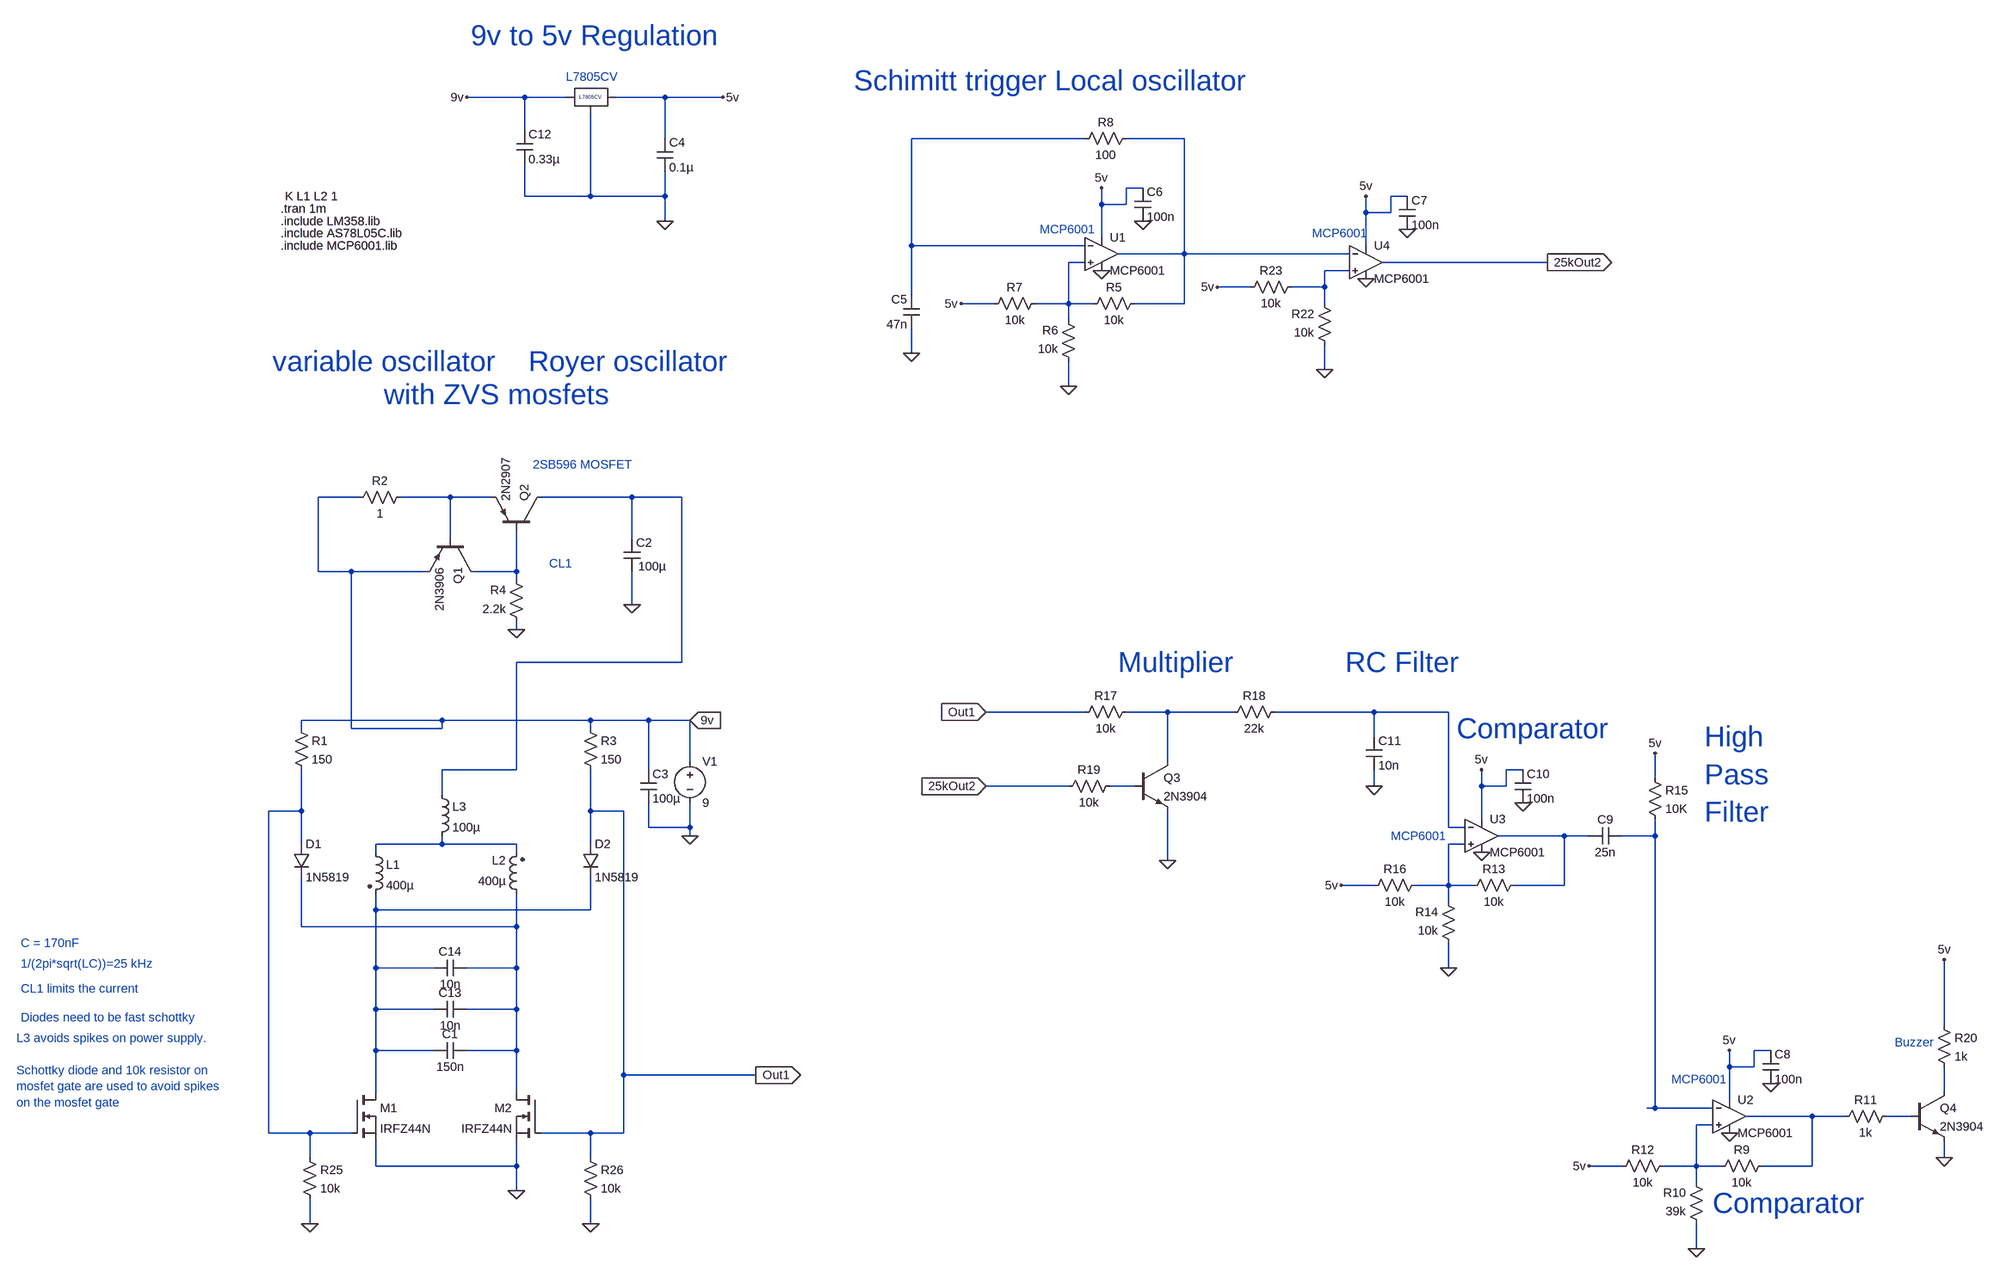
[diagram p0: schematic Model 2.asc]
Model 2.asc, the LTspice schematic file:
Version 4.1
SHEET 1 3832 2088
WIRE 480 -784 368 -784
WIRE 560 -784 480 -784
WIRE 752 -784 656 -784
WIRE 864 -784 752 -784
WIRE 480 -720 480 -784
WIRE 752 -704 752 -784
WIRE 1872 -704 1536 -704
WIRE 2064 -704 1952 -704
WIRE 1984 -608 1952 -608
WIRE 480 -592 480 -656
WIRE 608 -592 608 -752
WIRE 608 -592 480 -592
WIRE 752 -592 752 -640
WIRE 752 -592 608 -592
WIRE 2496 -592 2464 -592
WIRE 1904 -576 1904 -608
WIRE 1952 -576 1952 -608
WIRE 1952 -576 1904 -576
WIRE 2416 -560 2416 -592
WIRE 2464 -560 2464 -592
WIRE 2464 -560 2416 -560
WIRE 752 -544 752 -592
WIRE 1904 -512 1904 -576
WIRE 1536 -496 1536 -704
WIRE 1872 -496 1536 -496
WIRE 2416 -496 2416 -560
WIRE 2064 -480 2064 -704
WIRE 2064 -480 1936 -480
WIRE 2384 -480 2064 -480
WIRE 1872 -464 1840 -464
WIRE 2768 -464 2448 -464
WIRE 2384 -448 2336 -448
WIRE 2192 -416 2128 -416
WIRE 2336 -416 2336 -448
WIRE 2336 -416 2272 -416
WIRE 1536 -400 1536 -496
WIRE 1696 -384 1632 -384
WIRE 1840 -384 1840 -464
WIRE 1840 -384 1776 -384
WIRE 1888 -384 1840 -384
WIRE 2064 -384 2064 -480
WIRE 2064 -384 1968 -384
WIRE 2336 -384 2336 -416
WIRE 1840 -352 1840 -384
WIRE 1536 -288 1536 -336
WIRE 2336 -256 2336 -304
WIRE 1840 -224 1840 -272
WIRE 160 0 80 0
WIRE 336 0 240 0
WIRE 416 0 336 0
WIRE 688 0 512 0
WIRE 784 0 688 0
WIRE 336 80 336 0
WIRE 688 80 688 0
WIRE 80 144 80 0
WIRE 144 144 80 144
WIRE 288 144 144 144
WIRE 464 144 464 64
WIRE 464 144 384 144
WIRE 464 160 464 144
WIRE 688 208 688 144
WIRE 464 256 464 240
WIRE 784 320 784 0
WIRE 784 320 464 320
WIRE 1872 416 1680 416
WIRE 2032 416 1952 416
WIRE 2160 416 2032 416
WIRE 2432 416 2240 416
WIRE 2576 416 2432 416
WIRE 320 432 48 432
WIRE 608 432 320 432
WIRE 720 432 608 432
WIRE 800 432 720 432
WIRE 48 448 48 432
WIRE 144 448 144 144
WIRE 320 448 320 432
WIRE 320 448 144 448
WIRE 608 448 608 432
WIRE 2432 464 2432 416
WIRE 800 512 800 432
WIRE 2032 512 2032 416
WIRE 464 528 464 320
WIRE 464 528 320 528
WIRE 720 528 720 432
WIRE 2720 528 2688 528
WIRE 2976 544 2976 496
WIRE 1840 560 1680 560
WIRE 1968 560 1920 560
WIRE 2432 560 2432 528
WIRE 2640 560 2640 528
WIRE 2688 560 2688 528
WIRE 2688 560 2640 560
WIRE 320 576 320 528
WIRE 48 608 48 528
WIRE 48 608 -16 608
WIRE 608 608 608 528
WIRE 672 608 608 608
WIRE 2640 624 2640 560
WIRE 720 640 720 592
WIRE 800 640 800 592
WIRE 800 640 720 640
WIRE 2576 640 2576 416
WIRE 2608 640 2576 640
WIRE 800 656 800 640
WIRE 2800 656 2672 656
WIRE 2848 656 2800 656
WIRE 2976 656 2976 624
WIRE 2976 656 2912 656
WIRE 48 672 48 608
WIRE 320 672 320 656
WIRE 320 672 192 672
WIRE 464 672 320 672
WIRE 608 672 608 608
WIRE 2608 672 2576 672
WIRE 192 688 192 672
WIRE 464 688 464 672
WIRE 2032 704 2032 608
WIRE 2432 752 2368 752
WIRE 2576 752 2576 672
WIRE 2576 752 2512 752
WIRE 2624 752 2576 752
WIRE 2800 752 2800 656
WIRE 2800 752 2704 752
WIRE 2576 784 2576 752
WIRE 192 800 192 768
WIRE 608 800 608 736
WIRE 608 800 192 800
WIRE 48 832 48 736
WIRE 464 832 464 768
WIRE 464 832 48 832
WIRE 192 912 192 800
WIRE 304 912 192 912
WIRE 464 912 464 832
WIRE 464 912 368 912
WIRE 2576 912 2576 864
WIRE 192 992 192 912
WIRE 304 992 192 992
WIRE 464 992 464 912
WIRE 464 992 368 992
WIRE 3536 1024 3536 896
WIRE 192 1072 192 992
WIRE 304 1072 192 1072
WIRE 464 1072 464 992
WIRE 464 1072 368 1072
WIRE 3200 1072 3168 1072
WIRE 3120 1104 3120 1072
WIRE 3168 1104 3168 1072
WIRE 3168 1104 3120 1104
WIRE 672 1120 672 608
WIRE 928 1120 672 1120
WIRE 192 1152 192 1072
WIRE 464 1152 464 1072
WIRE 3536 1152 3536 1104
WIRE 3120 1168 3120 1104
WIRE 2976 1184 2976 656
WIRE 2976 1184 2960 1184
WIRE 3088 1184 2976 1184
WIRE 3280 1200 3152 1200
WIRE 3344 1200 3280 1200
WIRE 3472 1200 3424 1200
WIRE 3088 1216 3056 1216
WIRE -16 1232 -16 608
WIRE 64 1232 -16 1232
WIRE 144 1232 64 1232
WIRE 608 1232 512 1232
WIRE 672 1232 672 1120
WIRE 672 1232 608 1232
WIRE 64 1280 64 1232
WIRE 608 1280 608 1232
WIRE 3536 1280 3536 1248
WIRE 192 1296 192 1248
WIRE 464 1296 464 1248
WIRE 464 1296 192 1296
WIRE 2912 1296 2848 1296
WIRE 3056 1296 3056 1216
WIRE 3056 1296 2992 1296
WIRE 3104 1296 3056 1296
WIRE 3280 1296 3280 1200
WIRE 3280 1296 3184 1296
WIRE 3056 1328 3056 1296
WIRE 464 1344 464 1296
WIRE 64 1408 64 1360
WIRE 608 1408 608 1360
WIRE 3056 1456 3056 1408
FLAG 464 1344 0
FLAG 800 656 0
FLAG 464 256 0
FLAG 688 208 0
FLAG 928 1120 Out1
IOPIN 928 1120 Out
FLAG 800 432 9v
IOPIN 800 432 In
FLAG 752 -544 0
FLAG 368 -784 9v
FLAG 864 -784 5v
FLAG 1840 -224 0
FLAG 1536 -288 0
FLAG 1904 -448 0
FLAG 1984 -544 0
FLAG 1904 -608 5v
FLAG 1632 -384 5v
FLAG 3056 1456 0
FLAG 3120 1232 0
FLAG 3200 1136 0
FLAG 3120 1072 5v
FLAG 2848 1296 5v
FLAG 2576 912 0
FLAG 2640 688 0
FLAG 2720 592 0
FLAG 2640 528 5v
FLAG 2368 752 5v
FLAG 2032 704 0
FLAG 2432 560 0
FLAG 2976 496 5v
FLAG 1680 416 Out1
IOPIN 1680 416 In
FLAG 1680 560 25kOut2
IOPIN 1680 560 In
FLAG 3536 1280 0
FLAG 3536 896 5v
FLAG 64 1408 0
FLAG 608 1408 0
FLAG 2416 -432 0
FLAG 2496 -528 0
FLAG 2416 -592 5v
FLAG 2336 -256 0
FLAG 2128 -416 5v
FLAG 2768 -464 25kOut2
IOPIN 2768 -464 Out
SYMBOL res 32 432 R0
SYMATTR InstName R1
SYMATTR Value 150
SYMBOL res 592 432 R0
SYMATTR InstName R3
SYMATTR Value 150
SYMBOL ind2 176 672 R0
SYMATTR InstName L1
SYMATTR Value 400µ
SYMATTR Type ind
SYMBOL ind2 480 784 R180
WINDOW 0 36 80 Left 2
WINDOW 3 36 40 Left 2
SYMATTR InstName L2
SYMATTR Value 400µ
SYMATTR Type ind
SYMBOL ind 304 560 R0
SYMATTR InstName L3
SYMATTR Value 100µ
SYMBOL cap 368 1056 R90
WINDOW 0 0 32 VBottom 2
WINDOW 3 32 32 VTop 2
SYMATTR InstName C1
SYMATTR Value 150n
SYMBOL diode 32 672 R0
SYMATTR InstName D1
SYMATTR Value 1N5819
SYMBOL diode 592 672 R0
SYMATTR InstName D2
SYMATTR Value 1N5819
SYMBOL nmos 144 1152 R0
SYMATTR InstName M1
SYMATTR Value IRFZ44N
SYMBOL nmos 512 1152 M0
SYMATTR InstName M2
SYMATTR Value IRFZ44N
SYMBOL voltage 800 496 R0
WINDOW 123 0 0 Left 0
WINDOW 39 0 0 Left 0
SYMATTR InstName V1
SYMATTR Value 9
SYMBOL pnp 384 80 R90
SYMATTR InstName Q1
SYMATTR Value 2N3906
SYMBOL pnp 512 64 M270
SYMATTR InstName Q2
SYMATTR Value 2N2907
SYMBOL res 256 -16 R90
WINDOW 0 0 56 VBottom 2
WINDOW 3 32 56 VTop 2
SYMATTR InstName R2
SYMATTR Value 1
SYMBOL res 480 256 R180
WINDOW 0 36 76 Left 2
WINDOW 3 36 40 Left 2
SYMATTR InstName R4
SYMATTR Value 2.2k
SYMBOL cap 672 80 R0
WINDOW 3 28 54 Left 2
SYMATTR Value 100µ
SYMATTR InstName C2
SYMBOL cap 704 528 R0
SYMATTR InstName C3
SYMATTR Value 100µ
SYMBOL 78L05C 608 -784 R0
WINDOW 0 -22 0 Left 0
SYMATTR InstName L7805CV
SYMBOL cap 736 -704 R0
SYMATTR InstName C4
SYMATTR Value 0.1µ
SYMBOL res 1984 -400 R90
WINDOW 0 0 56 VBottom 2
WINDOW 3 32 56 VTop 2
SYMATTR InstName R5
SYMATTR Value 10k
SYMBOL res 1856 -256 R180
WINDOW 0 36 76 Left 2
WINDOW 3 36 40 Left 2
SYMATTR InstName R6
SYMATTR Value 10k
SYMBOL res 1968 -720 R90
WINDOW 0 0 56 VBottom 2
WINDOW 3 32 56 VTop 2
SYMATTR InstName R8
SYMATTR Value 100
SYMBOL cap 1552 -336 R180
WINDOW 0 24 56 Left 2
WINDOW 3 24 8 Left 2
SYMATTR InstName C5
SYMATTR Value 47n
SYMBOL res 1792 -400 R90
WINDOW 0 0 56 VBottom 2
WINDOW 3 32 56 VTop 2
SYMATTR InstName R7
SYMATTR Value 10k
SYMBOL cap 1968 -608 R0
SYMATTR InstName C6
SYMATTR Value 100n
SYMBOL OpAmps\\opamp2 3120 1136 R0
SYMATTR InstName U2
SYMATTR Value MCP6001
SYMBOL res 3200 1280 R90
WINDOW 0 0 56 VBottom 2
WINDOW 3 32 56 VTop 2
SYMATTR InstName R9
SYMATTR Value 10k
SYMBOL res 3072 1424 R180
WINDOW 0 36 76 Left 2
WINDOW 3 36 40 Left 2
SYMATTR InstName R10
SYMATTR Value 39k
SYMBOL res 3008 1280 R90
WINDOW 0 0 56 VBottom 2
WINDOW 3 32 56 VTop 2
SYMATTR InstName R12
SYMATTR Value 10k
SYMBOL cap 3184 1072 R0
SYMATTR InstName C8
SYMATTR Value 100n
SYMBOL OpAmps\\opamp2 2640 592 R0
SYMATTR InstName U3
SYMATTR Value MCP6001
SYMBOL res 2720 736 R90
WINDOW 0 0 56 VBottom 2
WINDOW 3 32 56 VTop 2
SYMATTR InstName R13
SYMATTR Value 10k
SYMBOL res 2592 880 R180
WINDOW 0 36 76 Left 2
WINDOW 3 36 40 Left 2
SYMATTR InstName R14
SYMATTR Value 10k
SYMBOL res 2528 736 R90
WINDOW 0 0 56 VBottom 2
WINDOW 3 32 56 VTop 2
SYMATTR InstName R16
SYMATTR Value 10k
SYMBOL cap 2704 528 R0
SYMATTR InstName C10
SYMATTR Value 100n
SYMBOL npn 1968 512 R0
SYMATTR InstName Q3
SYMATTR Value 2N3904
SYMBOL res 1968 400 R90
WINDOW 0 0 56 VBottom 2
WINDOW 3 32 56 VTop 2
SYMATTR InstName R17
SYMATTR Value 10k
SYMBOL res 2256 400 R90
WINDOW 0 0 56 VBottom 2
WINDOW 3 32 56 VTop 2
SYMATTR InstName R18
SYMATTR Value 22k
SYMBOL cap 2416 464 R0
SYMATTR InstName C11
SYMATTR Value 10n
SYMBOL res 1936 544 R90
WINDOW 0 0 56 VBottom 2
WINDOW 3 32 56 VTop 2
SYMATTR InstName R19
SYMATTR Value 10k
SYMBOL cap 2912 640 R90
WINDOW 0 0 32 VBottom 2
WINDOW 3 32 32 VTop 2
SYMATTR InstName C9
SYMATTR Value 25n
SYMBOL res 2960 528 R0
SYMATTR InstName R15
SYMATTR Value 10K
SYMBOL res 3440 1184 R90
WINDOW 0 0 56 VBottom 2
WINDOW 3 32 56 VTop 2
SYMATTR InstName R11
SYMATTR Value 1k
SYMBOL npn 3472 1152 R0
SYMATTR InstName Q4
SYMATTR Value 2N3904
SYMBOL res 3520 1008 R0
SYMATTR InstName R20
SYMATTR Value 1k
SYMBOL OpAmps\\opamp2 1904 -544 R0
SYMATTR InstName U1
SYMATTR Value MCP6001
SYMBOL res 48 1264 R0
SYMATTR InstName R25
SYMATTR Value 10k
SYMBOL res 592 1264 R0
SYMATTR InstName R26
SYMATTR Value 10k
SYMBOL cap 368 976 R90
WINDOW 0 0 32 VBottom 2
WINDOW 3 32 32 VTop 2
SYMATTR InstName C13
SYMATTR Value 10n
SYMBOL cap 368 896 R90
WINDOW 0 0 32 VBottom 2
WINDOW 3 32 32 VTop 2
SYMATTR InstName C14
SYMATTR Value 10n
SYMBOL cap 2480 -592 R0
SYMATTR InstName C7
SYMATTR Value 100n
SYMBOL OpAmps\\opamp2 2416 -528 R0
SYMATTR InstName U4
SYMATTR Value MCP6001
SYMBOL res 2352 -288 R180
WINDOW 0 36 76 Left 2
WINDOW 3 36 40 Left 2
SYMATTR InstName R22
SYMATTR Value 10k
SYMBOL res 2288 -432 R90
WINDOW 0 0 56 VBottom 2
WINDOW 3 32 56 VTop 2
SYMATTR InstName R23
SYMATTR Value 10k
SYMBOL cap 464 -720 R0
SYMATTR InstName C12
SYMATTR Value 0.33µ
TEXT 8 -568 Left 2 !.tran 1m
TEXT 16 -592 Left 2 !K L1 L2 1
TEXT -496 864 Left 2 ;C = 170nF
TEXT -496 904 Left 2 ;1/(2pi*sqrt(LC))=25 kHz
TEXT -496 952 Left 2 ;CL1 limits the current
TEXT 488 -272 Left 5 ;Royer oscillator
TEXT -496 1008 Left 2 ;Diodes need to be fast schottky
TEXT -504 1048 Left 2 ;L3 avoids spikes on power supply.\n \nSchottky diode and 10k resistor on \nmosfet gate are used to avoid spikes\non the mosfet gate
TEXT 528 128 Left 2 ;CL1
TEXT 376 -904 Left 5 ;9v to 5v Regulation
TEXT 8 -520 Left 2 !.include AS78L05C.lib
TEXT -8 -272 Left 5 ;variable oscillator
TEXT 1424 -816 Left 5 ;Schimitt trigger Local oscillator
TEXT 8 -544 Left 2 !.include LM358.lib
TEXT 1936 320 Left 5 ;Multiplier
TEXT 2376 320 Left 5 ;RC Filter
TEXT 2592 448 Left 5 ;Comparator
TEXT 3072 464 Left 5 ;High \nPass \nFilter
TEXT 3088 1368 Left 5 ;Comparator
TEXT 208 -208 Left 5 ;with ZVS mosfets
TEXT 496 -64 Left 2 ;2SB596 MOSFET
TEXT 560 -824 Left 2 ;L7805CV
TEXT 1784 -528 Left 2 ;MCP6001
TEXT 2312 -520 Left 2 ;MCP6001
TEXT 2464 656 Left 2 ;MCP6001
TEXT 3008 1128 Left 2 ;MCP6001
TEXT 3440 1056 Left 2 ;Buzzer
TEXT 8 -496 Left 2 !.include MCP6001.lib

The netlist it stands for:
* Model 2.asc
R1 9v N011 150
R3 9v Out1 150
L1 N014 N016 400µ
L2 N017 N014 400µ
L3 N006 N014 100µ
C1 N017 N016 150n
D1 N011 N017 1N5819
D2 Out1 N016 1N5819
M1 N016 N011 0 0 IRFZ44N
M2 N017 Out1 0 0 IRFZ44N
V1 9v 0 9
Q1 N007 N005 9v 0 2N3906
Q2 N006 N007 N005 0 2N2907
R2 N005 9v 1
R4 0 N007 2.2k
C2 N006 0 100µ
C3 9v 0 100µ
X§L7805CV 9v 0 5v AS78L05C  ; pins IN GND OUT
C4 5v 0 0.1µ
R5 N002 N003 10k
R6 0 N003 10k
R8 N002 N001 100
C5 0 N001 47n
R7 N003 5v 10k
C6 5v 0 100n
X§U2 N021 N013 5v 0 N019 MCP6001  ; pins In+ In- V+ V- OUT
R9 N019 N021 10k
R10 0 N021 39k
R12 N021 5v 10k
C8 5v 0 100n
X§U3 N015 N009 5v 0 N012 MCP6001  ; pins In+ In- V+ V- OUT
R13 N012 N015 10k
R14 0 N015 10k
R16 N015 5v 10k
C10 5v 0 100n
Q3 N008 N010 0 0 2N3904
R17 N008 Out1 10k
R18 N009 N008 22k
C11 N009 0 10n
R19 N010 25kOut2 10k
C9 N013 N012 25n
R15 5v N013 10K
R11 N020 N019 1k
Q4 N018 N020 0 0 2N3904
R20 5v N018 1k
X§U1 N003 N001 5v 0 N002 MCP6001  ; pins In+ In- V+ V- OUT
R25 N011 0 10k
R26 Out1 0 10k
C13 N017 N016 10n
C14 N017 N016 10n
C7 5v 0 100n
X§U4 N004 N002 5v 0 25kOut2 MCP6001  ; pins In+ In- V+ V- OUT
R22 0 N004 10k
R23 N004 5v 10k
C12 9v 0 0.33µ
.model D D
.lib standard.dio
.model NPN NPN
.model PNP PNP
.lib standard.bjt
.model NMOS NMOS
.model PMOS PMOS
.lib standard.mos
.tran 1m
K L1 L2 1
* C = 170nF
* 1/(2pi*sqrt(LC))=25 kHz
* CL1 limits the current
* Royer oscillator
* Diodes need to be fast schottky
* L3 avoids spikes on power supply.
* Schottky diode and 10k resistor on
* mosfet gate are used to avoid spikes
* on the mosfet gate
* CL1
* 9v to 5v Regulation
.include AS78L05C.lib
* variable oscillator
* Schimitt trigger Local oscillator
.include LM358.lib
* Multiplier
* RC Filter
* Comparator
* High
* Pass
* Filter
* Comparator
* with ZVS mosfets
* 2SB596 MOSFET
* L7805CV
* MCP6001
* MCP6001
* MCP6001
* MCP6001
* Buzzer
.include MCP6001.lib
.backanno
.end

* Results of the author's LTspice run, read from the files saved beside the schematic
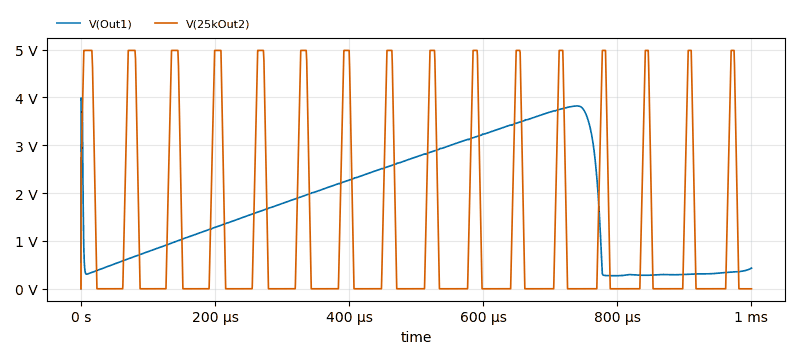
[diagram p1: Transient Analysis of Model 2.asc, plotted from the saved traces]
* Transient Analysis, 1 run:
*   V(Out1): min 3.15 mV, max 3.99 V, average 1.752 V, rms 2.127 V, last 432.4 mV
*   V(25kOut2): min 16.83 µV, max 4.984 V, average 1.192 V, rms 2.227 V, last 181.5 µV